# Altium schematic sheet SDCard.SchDoc: Ixora
size A3; Organization: Toradex AG; Address1: Altsagenstrasse 5; Address2: Horw; Address3: 6048; Address4: Switzerland; DocumentNumber: 8; Revision: V1.1; SheetNumber: 8; SheetTotal: 19; PageSetup: Record=PageOptions|CenterHorizontal=True|CenterVertical=True|PrintScale=0.71|XCorrection=1.00|YCorrection=1.00|PrintKind=0|BorderSize=5000000|LeftOffset=0|BottomOffset=0|Orientation=2|PaperLength=1000|PaperWidth=1000|Scale=100|PaperSource=7|PrintQuality=-4|MediaType=1|DitherType=10|PaperKind=A4|PrintScaleMode=1
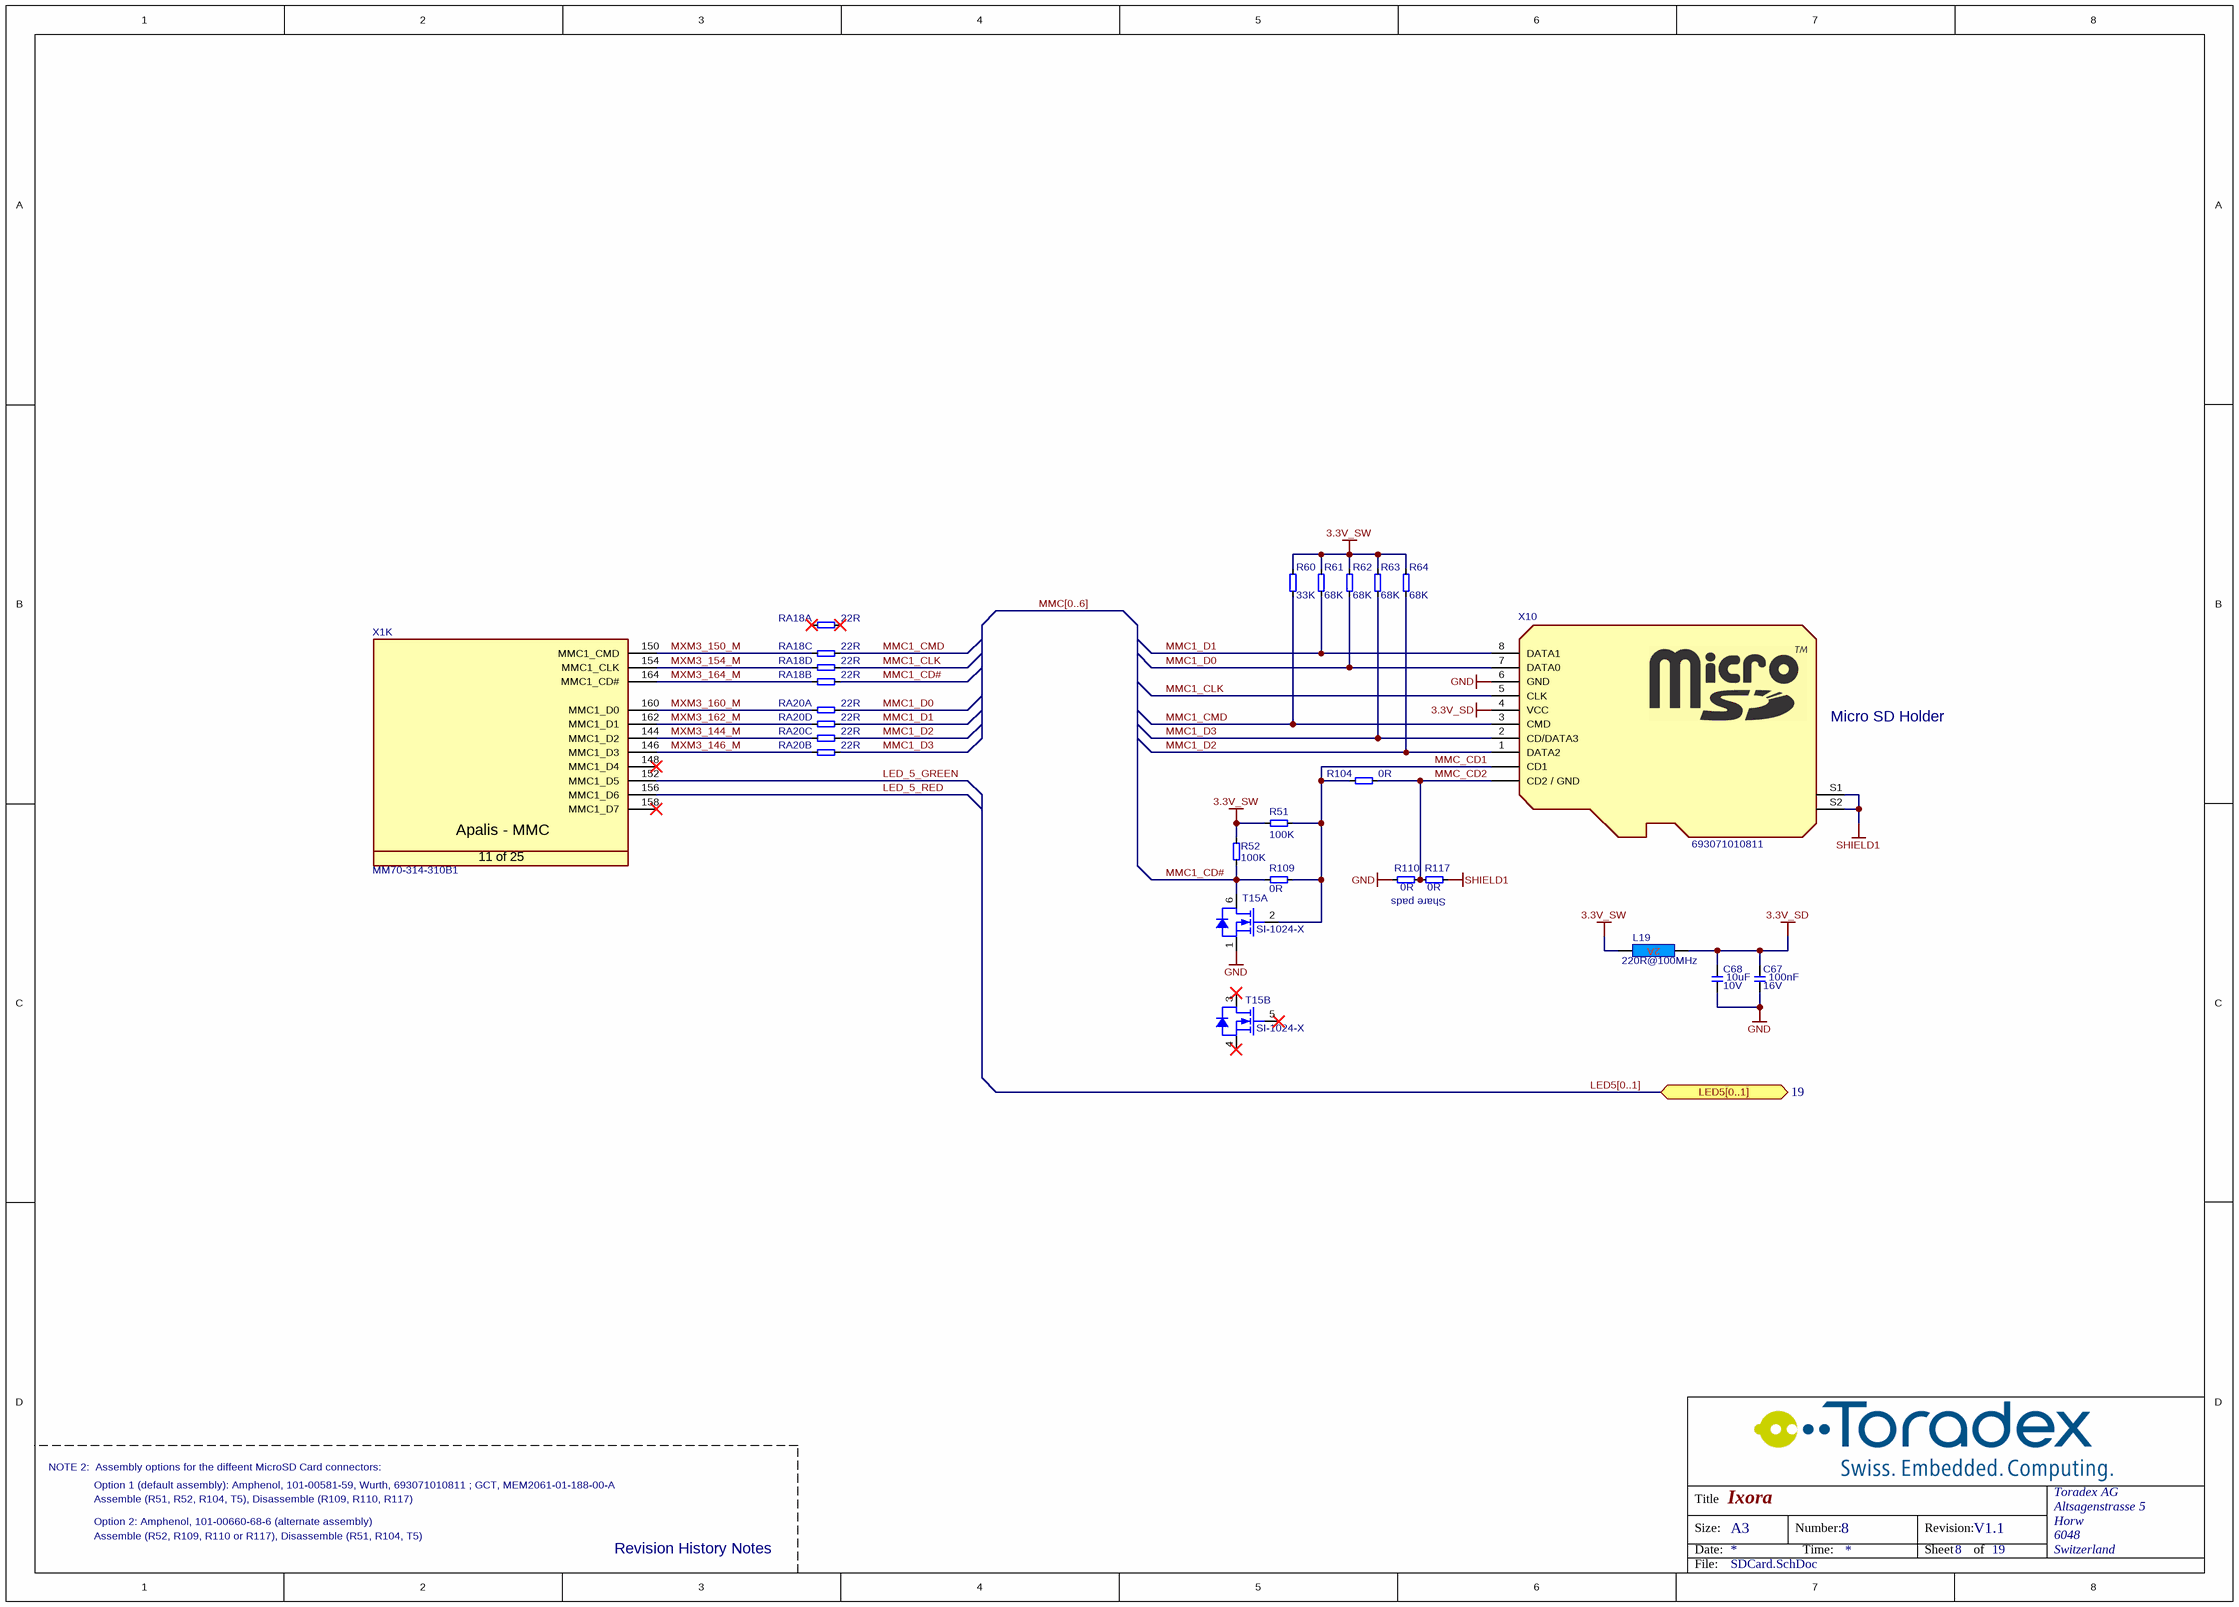
[diagram p0: SDCard.SchDoc]

## Parts
C67  Rating: 16V  [CAPC1005X60N]  (hidden comment: 100nF)
C68  Rating: 10V  [T_CAPC0603X33N]  (hidden comment: 10uF)
L19  220R@100MHz  [INDC1608X95N]
R51  100K  [RESC1005X40N]
R52  100K  [RESC1005X40N]
R60  33K  [RESC1005X40N]
R61  68K  [RESC1005X40N]
R62  68K  [RESC1005X40N]
R63  68K  [RESC1005X40N]
R64  68K  [RESC1005X40N]
R104  0R  [RESC1005X40N]
R109  0R  [RESC1005X40N]
R110  0R  [RESC1005X40N]
R117  0R  [RESC1005X40N]
RA18  22R  [T_Resistor_Array_X4]  (parts A,B,C,D of 4)
RA20  22R  [T_Resistor_Array_X4]  (parts A,B,C,D of 4)
T15  Manufacturer Part No.: SI-1024-X  [SOTFL50P160X60-6N]  (hidden comment: T-Vishay-SI-1024X-N)  (parts A,B of 2)
X1  Manufacturer Part No.: MM70-314-310B1  [T_JAE_MM70-314-310B1]  (hidden comment: CON-JAE-MM70-314-310B1-314-0.5mm)  (part K of 25)
X10  Manufacturer Part No.: 693071010811  [T_Wurth_693071010811]  (hidden comment: MicroSD Holder)

## Ports
LED5[0..1] (bidir, see 19)

## Nets
3.3V_SD: C67.2 C68.2 L19.1 X10.4(VCC)
3.3V_SW: L19.2 R51.2 R52.2 R60.2 R61.2 R62.2 R63.2 R64.2
GND: C67.1 C68.1 R110.1 T15.1(S) X10.6(GND)
SHIELD1: R117.2 X10.S1(S) X10.S2(S)
LED_5_GREEN: X1.152(MMC1_D5)
LED_5_RED: X1.156(MMC1_D6)
MMC1_CD#: R52.1 R109.1 RA18.6 T15.6(D)
MMC1_CLK: RA18.8 X10.5(CLK)
MMC1_CMD: R60.1 RA18.7 X10.3(CMD)
MMC1_D0: R62.1 RA20.5 X10.7(DATA0)
MMC1_D1: R61.1 RA20.8 X10.8(DATA1)
MMC1_D2: R64.1 RA20.7 X10.1(DATA2)
MMC1_D3: R63.1 RA20.6 X10.2(CD/DATA3)
MMC_CD1: R51.1 R104.2 R109.2 T15.2(G) X10.CD1
MMC_CD2: R104.1 R110.2 R117.1 X10.CD2(CD2_/_GND)
MXM3_144_M: RA20.3 X1.144(MMC1_D2)
MXM3_146_M: RA20.2 X1.146(MMC1_D3)
MXM3_150_M: RA18.3 X1.150(MMC1_CMD)
MXM3_154_M: RA18.4 X1.154(MMC1_CLK)
MXM3_160_M: RA20.1 X1.160(MMC1_D0)
MXM3_162_M: RA20.4 X1.162(MMC1_D1)
MXM3_164_M: RA18.2 X1.164(MMC1_CD#)

Not connected (* = marked no-connect by the designer): RA18 1* 5*; T15 3(D)* 4(S)* 5(G)*; X1 148(MMC1_D4)* 158(MMC1_D7)*

## Buses and harness runs
bus LED5[0..1] = port LED5[0..1]
bus MMC[0..6]

## Notes on the sheet
- (near X10) Micro SD Holder
- Share pads
- NOTE 2:  Assembly options for the diffeent MicroSD Card connectors:
- Option 1 (default assembly): Amphenol, 101-00581-59, Wurth, 693071010811 ; GCT, MEM2061-01-188-00-A
- Option 2: Amphenol, 101-00660-68-6 (alternate assembly)
- Assemble (R51, R52, R104, T5), Disassemble (R109, R110, R117)
- Assemble (R52, R109, R110 or R117), Disassemble (R51, R104, T5)
- Revision History Notes
- Title
- Size:
- Date:
- A3
- Number:
- Time:
- Revision:
- Sheet
- of
- File:
- (in symbol CON-JAE-MM70-314-310B1-314-0.5mm, part K) Apalis - MMC; 11 of 25

## Library data of the parts
C67 = C-X7R-100nF-16V-10%-0402: Capacitor Ceramic X7R 100nF 16V 10% 0402; Tolerance: 10%; Type: X7R; Value: 100nF
C68 = C-X5R-10uF-10V-20%-0603: Capacitor Ceramic X5R 10uF 10V 20% 0603; Tolerance: 20%; Type: X5R; Value: 10uF
L19 = L-220R@100MHz-2A-25%-0603: 220R@100MHz 2A EMI FILTER; Tolerance: 25%; Rating: 2A; Value: 220R@100MHz
R51 R52 = R-100KR-63mW-5%-0402: Resistor 100 Kohm 63mW 5% 0402; Value: 100KR; Rating: 63mW; Tolerance: 5%
R60 = R-33KR-63mW-5%-0402: Resistor 33 Kohm 63mW 5% 0402; Value: 33KR; Rating: 63mW; Tolerance: 5%
R61-R64 = R-68KR-63mW-5%-0402: Resistor 68 Kohm 63mW 5% 0402; Value: 68KR; Rating: 63mW; Tolerance: 5%
R104 R109 R110 R117 = R-0R-63mW-1%-0402: Resistor 0 ohm 63mW 1% 0402; Rating: 63mW; Tolerance: 1%; Value: 0R
RA18 RA20 = RA-22R-63mW-5%-1206-div: Resistor Array 22 R 63mW 5% 1206; Tolerance: 5%; Power Dissipation: 63mW; Value: 22R
T15 = T-Vishay-SI-1024X-N: Dual N-Channel 20V (D-S)  MOSFET; Manufacturer Name: Vishay
X1 = CON-JAE-MM70-314-310B1-314-0.5mm: MXM3 Connector; Manufacturer Name: JAE; No. of ways: 314
X10 = CON-Wurth-693071010811: Micro SD Holder Push Push CD; Manufacturer Name: Wurth; No. of ways: 9